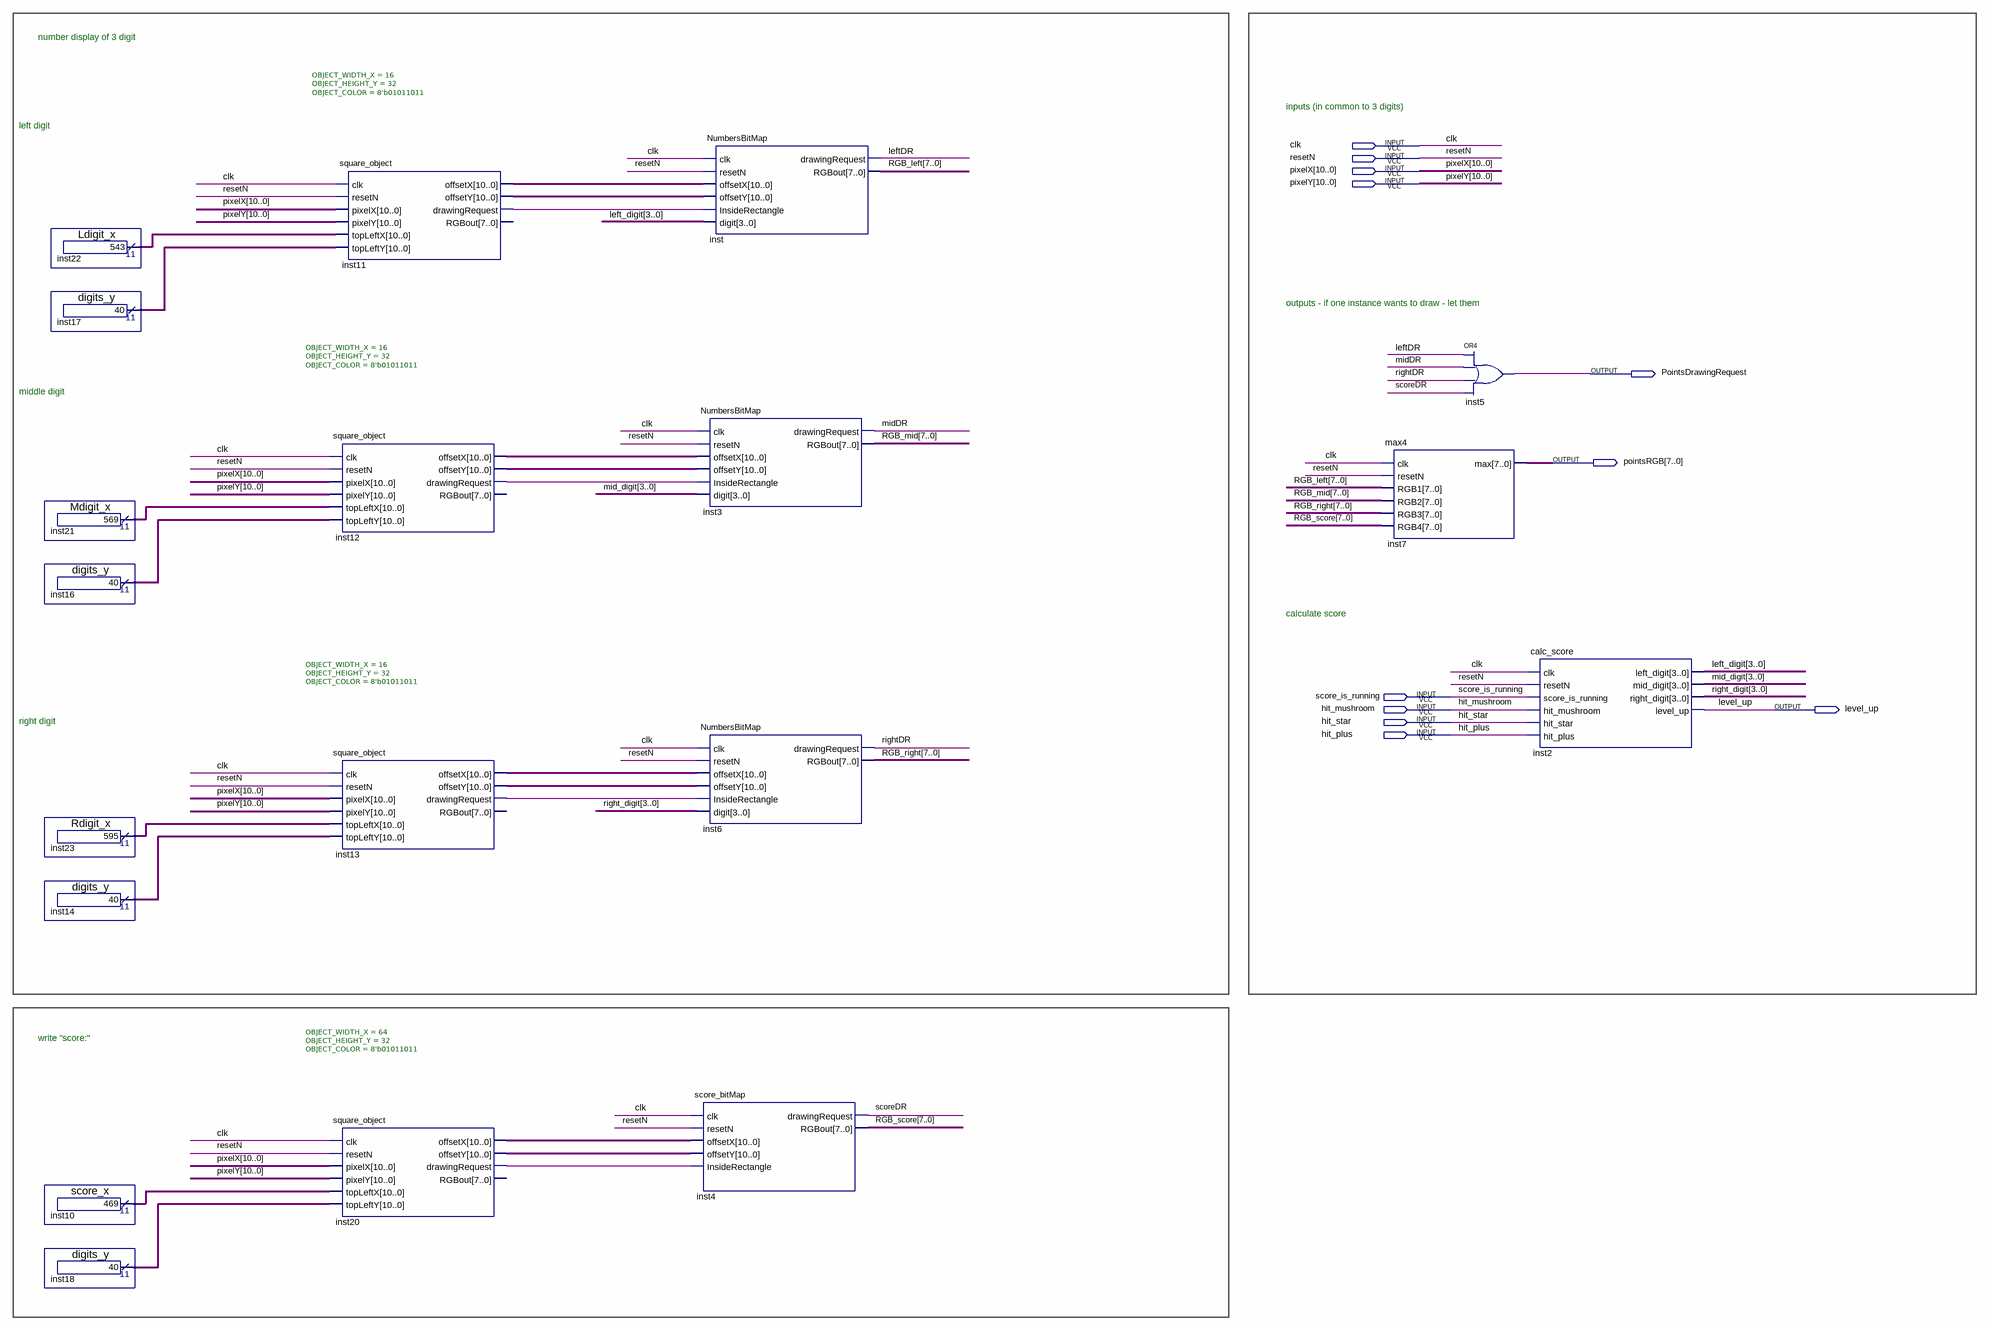
[diagram p0: schematic sheet]
// Quartus schematic POINTS_DISPLAY.bdf as structural Verilog: 19 symbols, 11 pins
module POINTS_DISPLAY (
  input  clk,
  input  resetN,
  input  [10:0] pixelX,
  input  [10:0] pixelY,
  input  score_is_running,
  input  hit_mushroom,
  input  hit_star,
  input  hit_plus,
  output PointsDrawingRequest,
  output [7:0] pointsRGB,
  output level_up
);

  wire inst11_drawingrequest, inst12_drawingrequest, inst13_drawingrequest, inst20_drawingrequest, leftDR,
       midDR, rightDR, scoreDR;
  wire [3:0] left_digit, mid_digit, right_digit;
  wire [7:0] RGB_left, RGB_mid, RGB_right, RGB_score;
  wire [10:0] inst10_result, inst11_offsetx, inst11_offsety, inst12_offsetx, inst12_offsety, inst13_offsetx,
       inst13_offsety, inst14_result, inst16_result, inst17_result, inst18_result, inst20_offsetx,
       inst20_offsety, inst21_result, inst22_result, inst23_result;

  Ldigit_x inst22 (.result(inst22_result));
  digits_y inst17 (.result(inst17_result));
  Mdigit_x inst21 (.result(inst21_result));
  digits_y inst16 (.result(inst16_result));
  Rdigit_x inst23 (.result(inst23_result));
  digits_y inst14 (.result(inst14_result));
  score_x inst10 (.result(inst10_result));
  digits_y inst18 (.result(inst18_result));
  square_object #(.OBJECT_WIDTH_X(16), .OBJECT_HEIGHT_Y(32), .OBJECT_COLOR(8'b01011011)) inst12 (
    .clk(clk), .resetN(resetN), .pixelX(pixelX), .pixelY(pixelY), .topLeftX(inst21_result),
    .topLeftY(inst16_result), .offsetX(inst12_offsetx), .offsetY(inst12_offsety),
    .drawingRequest(inst12_drawingrequest));  // open: RGBout
  square_object #(.OBJECT_WIDTH_X(16), .OBJECT_HEIGHT_Y(32), .OBJECT_COLOR(8'b01011011)) inst13 (
    .clk(clk), .resetN(resetN), .pixelX(pixelX), .pixelY(pixelY), .topLeftX(inst23_result),
    .topLeftY(inst14_result), .offsetX(inst13_offsetx), .offsetY(inst13_offsety),
    .drawingRequest(inst13_drawingrequest));  // open: RGBout
  square_object #(.OBJECT_WIDTH_X(64), .OBJECT_HEIGHT_Y(32), .OBJECT_COLOR(8'b01011011)) inst20 (
    .clk(clk), .resetN(resetN), .pixelX(pixelX), .pixelY(pixelY), .topLeftX(inst10_result),
    .topLeftY(inst18_result), .offsetX(inst20_offsetx), .offsetY(inst20_offsety),
    .drawingRequest(inst20_drawingrequest));  // open: RGBout
  square_object #(.OBJECT_WIDTH_X(16), .OBJECT_HEIGHT_Y(32), .OBJECT_COLOR(8'b01011011)) inst11 (
    .clk(clk), .resetN(resetN), .pixelX(pixelX), .pixelY(pixelY), .topLeftX(inst22_result),
    .topLeftY(inst17_result), .offsetX(inst11_offsetx), .offsetY(inst11_offsety),
    .drawingRequest(inst11_drawingrequest));  // open: RGBout
  NumbersBitMap inst (
    .clk(clk), .resetN(resetN), .offsetX(inst11_offsetx), .offsetY(inst11_offsety),
    .InsideRectangle(inst11_drawingrequest), .digit(left_digit), .drawingRequest(leftDR), .RGBout(RGB_left));
  NumbersBitMap inst3 (
    .clk(clk), .resetN(resetN), .offsetX(inst12_offsetx), .offsetY(inst12_offsety),
    .InsideRectangle(inst12_drawingrequest), .digit(mid_digit), .drawingRequest(midDR), .RGBout(RGB_mid));
  NumbersBitMap inst6 (
    .clk(clk), .resetN(resetN), .offsetX(inst13_offsetx), .offsetY(inst13_offsety),
    .InsideRectangle(inst13_drawingrequest), .digit(right_digit), .drawingRequest(rightDR), .RGBout(RGB_right));
  score_bitMap inst4 (
    .clk(clk), .resetN(resetN), .offsetX(inst20_offsetx), .offsetY(inst20_offsety),
    .InsideRectangle(inst20_drawingrequest), .drawingRequest(scoreDR), .RGBout(RGB_score));
  max4 inst7 (
    .clk(clk), .resetN(resetN), .RGB1(RGB_left), .RGB2(RGB_mid), .RGB3(RGB_right), .RGB4(RGB_score),
    .max(pointsRGB));
  or inst5 (PointsDrawingRequest, leftDR, midDR, rightDR, scoreDR);
  calc_score inst2 (
    .clk(clk), .resetN(resetN), .score_is_running(score_is_running), .hit_mushroom(hit_mushroom),
    .hit_star(hit_star), .hit_plus(hit_plus), .left_digit(left_digit), .mid_digit(mid_digit),
    .right_digit(right_digit), .level_up(level_up));

  // Notes on the sheet:
  //   number display of 3 digit
  //   inputs (in common to 3 digits)
  //   left digit
  //   outputs - if one instance wants to draw - let them
  //   middle digit
  //   calculate score
  //   right digit
  //   write "score:"
endmodule
